# EAGLE schematic MKRWiFi1010V2.0 (EAGLE 9.3.0)

## Sheet 1 of 2
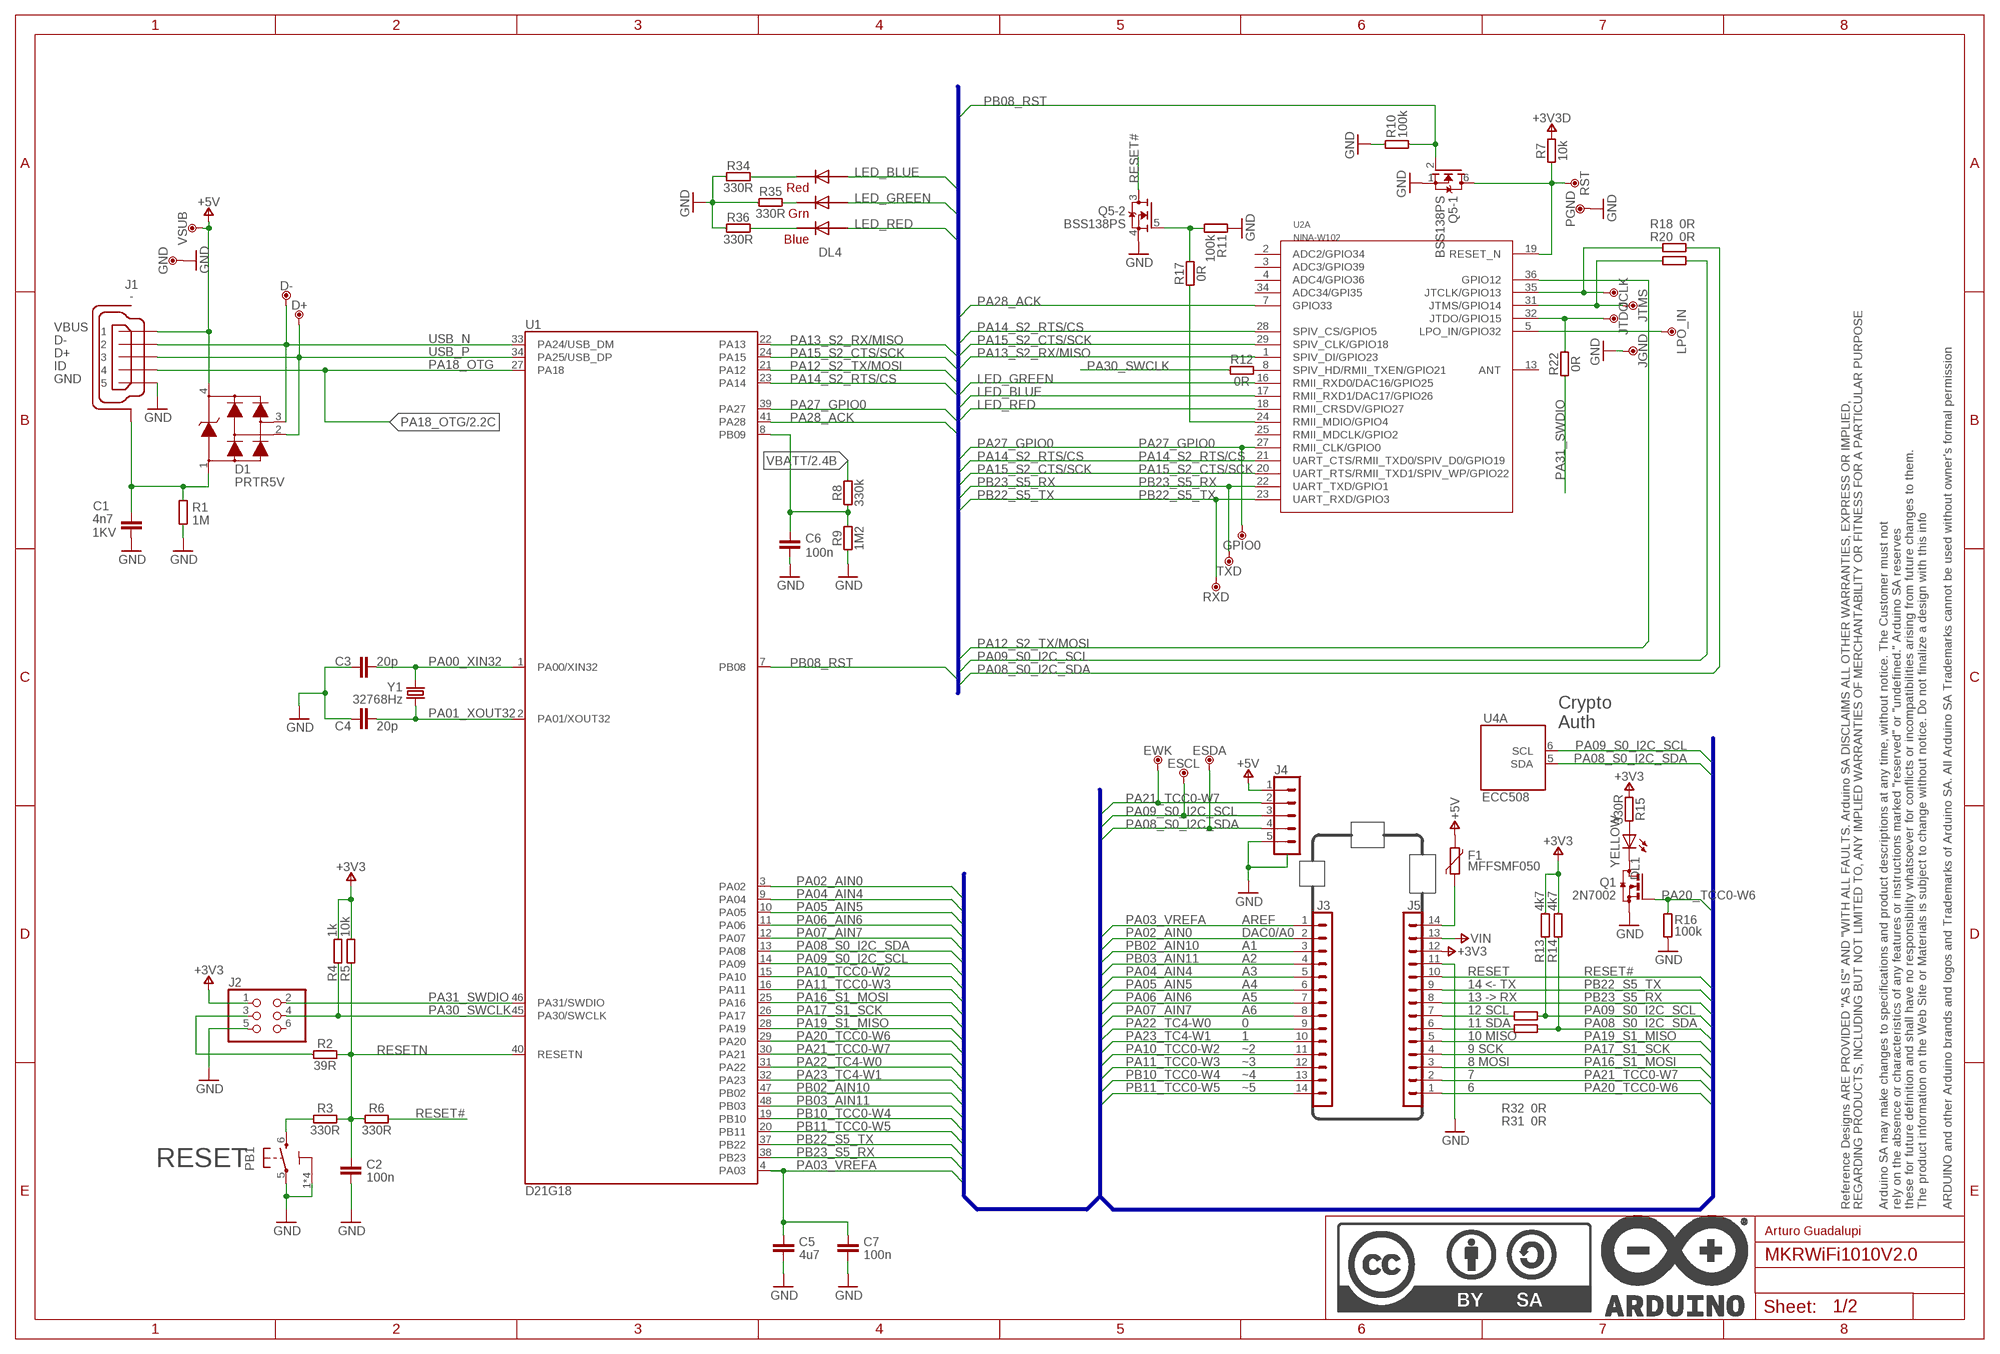
[diagram p0: schematic, sheet 1]

### Parts
C1  4n7  C4.7NF-0805  [0805-R2013X50N]
C2  100n  C-100NF-0402  [0402-1005X55N]
C3  20p  C-20PF-0402  [0402-1005X55N]
C4  20p  C-20PF-0402  [0402-1005X55N]
C5  4u7  C-4.7UF-0402  [0402-1005X55N]
C6  100n  C-100NF-0402  [0402-1005X55N]
C7  100n  C-100NF-0402  [0402-1005X55N]
D1  PRTR5V  PRTR5V0U2X,215  [SOT190P230X110-4N]
D+  DNP  TPTP-1.00MM  [TP-1.00MM]
D-  DNP  TPTP-1.00MM  [TP-1.00MM]
DL1  YELLOW  LED-YELLOW-0603  [LEDC1608X80N-AK]
DL4  RGB  RGBLED5050  [RGBLED]
ESCL  DNP  TPTP-1.00MM  [TP-1.00MM]
ESDA  DNP  TPTP-1.00MM  [TP-1.00MM]
EWK  DNP  TPTP-1.00MM  [TP-1.00MM]
F1  MFFSMF050  PTC  [0603-1608X90N]
FRAME1  DNP  A3-FRAME  [FRAME]
GND  DNP  TPTP-1.00MM  [TP-1.00MM]
GPIO0  DNP  TPTP-0.8MM  [TP-0.8MM]
J1  -  USB-MICRO  [ZX62-AB-5PA]
J2  DNP  PINHD-2X03-DNPSMD-NH  [2X3_SMT]
J3  -  PINHD-1X14-SM-MALE/FEMALETH-SMD  [1X14_SMD_TH]
J4  -  SM05B-SRSS-TB  [SM05B-SRSS-TB]
J5  -  PINHD-1X14-SM-MALE/FEMALETH-SMD  [1X14_SMD_TH]
JCLK  DNP  TPTP-0.8MM  [TP-0.8MM]
JGND  DNP  TPTP-0.8MM  [TP-0.8MM]
JTDO  DNP  TPTP-0.8MM  [TP-0.8MM]
JTMS  DNP  TPTP-0.8MM  [TP-0.8MM]
LPO_IN  DNP  TPTP-1.27MM  [TP-1.27MM]
PB1  PTS820  TACTILE1PTS820-NH  [C&K_PTS820_NO_HOLES]
PGND  DNP  TPTP-0.8MM  [TP-0.8MM]
Q1  2N7002  2N7002T-SOT523  [SOTFL50P160X78-3]
Q5  BSS138PS  [SOT363]
R1  1M  R-1M-0402  [0402-1005X55N]
R2  39R  R-39R-0402  [0402-1005X55N]
R3  330R  R-330R-0402  [0402-1005X55N]
R4  1k  R-1K-0402  [0402-1005X55N]
R5  10k  R-10K-0402  [0402-1005X55N]
R6  330R  R-330R-0402  [0402-1005X55N]
R7  10k  R-10K-0402  [0402-1005X55N]
R8  330k  R-330K-0402  [0402-1005X55N]
R9  1M2  R-1M2-0402  [0402-1005X55N]
R10  100k  R-100K-0402  [0402-1005X55N]
R11  100k  R-100K-0402  [0402-1005X55N]
R12  0R  R-0R-0402  [0402-1005X55N]
R13  4k7  R-4K7-0402  [0402-1005X55N]
R14  4k7  R-4K7-0402  [0402-1005X55N]
R15  330R  R-330R-0402  [0402-1005X55N]
R16  100k  R-100K-0402  [0402-1005X55N]
R17  0R  R-0R-0402  [0402-1005X55N]
R18  0R  R-0R-0402  [0402-1005X55N]
R20  0R  R-0R-0402  [0402-1005X55N]
R22  0R  R-0R-0402  [0402-1005X55N]
R31  0R  R-0R-0402  [0402-1005X55N]
R32  0R  R-0R-0402  [0402-1005X55N]
R34  330R  R-330R-0402  [0402-1005X55N]
R35  330R  R-330R-0402  [0402-1005X55N]
R36  330R  R-330R-0402  [0402-1005X55N]
RST  DNP  TPTP-0.8MM  [TP-0.8MM]
RXD  DNP  TPTP-0.8MM  [TP-0.8MM]
TXD  DNP  TPTP-0.8MM  [TP-0.8MM]
U1  D21G18  ATSAMD21G18A-48QFN  [QFN50P700X700X90-49XN-EPSQ515]
U2  NINA-W102  NINA-W1X-102  [NINA-W1X]
U4  ECC508  ATECC508A-MAHDA-T8-UDFN  [SON50P300X200X60-9N-EP160X140]
VSUB  DNP  TPTP-1.00MM  [TP-1.00MM]
Y1  32768Hz  32.768KHZ  [ABS07]

### Nets
+3V3: J2.1 J5.12 R4.2 R5.2 R13.2 R14.2 R15.1 ; also sheet 2
+3V3D: R7.2 ; also sheet 2
+5V: D1.4 F1.2 J1.1 J4.1 VSUB.X ; also sheet 2
GND: C1.2 C2.2 C3.1 C4.1 C5.2 C6.2 C7.2 GND.X J1.5 J2.5 J4.5 J4.SH1(SH) J4.SH2(SH) J5.11 JGND.X PB1.1 PB1.2 PB1.3 PB1.4 PB1.5 PGND.X Q1.S Q5.1(-1:S) Q5.4(-2:S) R1.1 R9.1 R10.2 R11.2 R16.1 R34.1 R35.1 R36.1 ; also sheet 2
LED_BLUE: DL4.2(RED_A) U2.17(A:RMII_RXD1/DAC17/GPIO26)
LED_GREEN: DL4.1(GREEN_A) U2.16(A:RMII_RXD0/DAC16/GPIO25)
LED_RED: DL4.3(BLUE_A) U2.18(A:RMII_CRSDV/GPIO27)
N17658775: PB1.6 R3.1
N$1: C1.1 D1.1 J1.6(SH) J1.7(SH) J1.8(SH) J1.9(SH) J1.10(SH) J1.11(SH) R1.2
N$2: F1.1 J5.14
N$4: J2.3 R2.1
N$5: J5.7 R32.1
N$6: C6.1 R8.1 R9.2 U1.8(PB09)
N$7: DL1.A R15.2
N$8: J5.6 R31.1
N$9: Q5.6(-1:D) R7.1 RST.X U2.19(A:RESET_N)
N$10: DL1.C Q1.D
N$11: JCLK.X R18.1 U2.35(A:JTCLK/GPIO13)
N$12: JTMS.X R20.1 U2.31(A:JTMS/GPIO14)
N$13: R17.1 U2.24(A:RMII_MDIO/GPIO4)
N$14: DL4.5(RED_C) R34.2
N$16: DL4.6(GREEN_C) R35.2
N$20: DL4.4(BLUE_C) R36.2
N$25: LPO_IN.X U2.5(A:LPO_IN/GPIO32)
N$26: JTDO.X R22.2 U2.32(A:JTDO/GPIO15)
N$27: R12.2 U2.8(A:SPIV_HD/RMII_TXEN/GPIO21)
N$28: Q5.5(-2:G) R11.1 R17.2
PA00_XIN32: C3.2 U1.1(PA00/XIN32) Y1.2
PA01_XOUT32: C4.2 U1.2(PA01/XOUT32) Y1.1
PA02_AIN0: J3.2 U1.3(PA02)
PA03_VREFA: C5.1 C7.1 J3.1 U1.4(PA03)
PA04_AIN4: J3.5 U1.9(PA04)
PA05_AIN5: J3.6 U1.10(PA05)
PA06_AIN6: J3.7 U1.11(PA06)
PA07_AIN7: J3.8 U1.12(PA07)
PA08_S0_I2C_SDA: ESDA.X J4.4 R14.1 R18.2 R31.2 U1.13(PA08) U4.5(A:SDA) ; also sheet 2
PA09_S0_I2C_SCL: ESCL.X J4.3 R13.1 R20.2 R32.2 U1.14(PA09) U4.6(A:SCL) ; also sheet 2
PA10_TCC0-W2: J3.11 U1.15(PA10)
PA11_TCC0-W3: J3.12 U1.16(PA11)
PA12_S2_TX/MOSI: U1.21(PA12) U2.36(A:GPIO12)
PA13_S2_RX/MISO: U1.22(PA13) U2.1(A:SPIV_DI/GPIO23)
PA14_S2_RTS/CS: U1.23(PA14) U2.21(A:UART_CTS/RMII_TXD0/SPIV_D0/GPIO19) U2.28(A:SPIV_CS/GPIO5)
PA15_S2_CTS/SCK: U1.24(PA15) U2.20(A:UART_RTS/RMII_TXD1/SPIV_WP/GPIO22) U2.29(A:SPIV_CLK/GPIO18)
PA16_S1_MOSI: J5.3 U1.25(PA16)
PA17_S1_SCK: J5.4 U1.26(PA17)
PA18_OTG: J1.4 U1.27(PA18) ; also sheet 2
PA19_S1_MISO: J5.5 U1.28(PA19)
PA20_TCC0-W6: J5.1 Q1.G R16.2 U1.29(PA20)
PA21_TCC0-W7: EWK.X J4.2 J5.2 U1.30(PA21)
PA22_TC4-W0: J3.9 U1.31(PA22)
PA23_TC4-W1: J3.10 U1.32(PA23)
PA27_GPIO0: GPIO0.X U1.39(PA27) U2.27(A:RMII_CLK/GPIO0)
PA28_ACK: U1.41(PA28) U2.7(A:GPIO33)
PA30_SWCLK: J2.4 R4.1 R12.1 U1.45(PA30/SWCLK)
PA31_SWDIO: J2.2 R22.1 U1.46(PA31/SWDIO)
PB02_AIN10: J3.3 U1.47(PB02)
PB03_AIN11: J3.4 U1.48(PB03)
PB08_RST: Q5.2(-1:G) R10.1 U1.7(PB08)
PB10_TCC0-W4: J3.13 U1.19(PB10)
PB11_TCC0-W5: J3.14 U1.20(PB11)
PB22_S5_TX: J5.9 RXD.X U1.37(PB22) U2.23(A:UART_RXD/GPIO3)
PB23_S5_RX: J5.8 TXD.X U1.38(PB23) U2.22(A:UART_TXD/GPIO1)
RESET#: J5.10 Q5.3(-2:D) R6.2
RESETN: C2.1 R2.2 R3.2 R5.1 R6.1 U1.40(RESETN)
USB_N [usb]: D1.3 D-.X J1.2 U1.33(PA24/USB_DM)
USB_P [usb]: D1.2 D+.X J1.3 U1.34(PA25/USB_DP)
VBATT: R8.2 ; also sheet 2
VIN: J5.13 ; also sheet 2
Unconnected: J2.6 U2.2(A:ADC2/GPIO34) U2.3(A:ADC3/GPIO39) U2.4(A:ADC4/GPIO36) U2.13(A:ANT) U2.25(A:RMII_MDCLK/GPIO2) U2.34(A:ADC34/GPI35)

### Buses
PA03_VREFA,PA02_AIN0,PB02_AIN10,PB03_AIN11,PA04_AIN4,PA05_AIN5,PA06_AIN6,PA07_AIN7,PA22_TC4-W0,PA23_TC4-W1,PA10_TCC0-W2,PA11_TCC0-W3,PB10_TCC0-W4,PB11_TCC0-W5,PA20_TCC0-W6,PA21_TCC0-W7,PA16_S1_MOSI,PA17_S1_SCK,PA19_S1_MISO,PA08_S0_I2C_SDA,PA09_S0_I2C_SCL,PB23_S5_RX,PB22_S5_TX,RESET#
B$2

### Notes on the sheet
- Crypto
  Auth
- AREF
- DAC0/A0
- A1
- A2
- A3 | RESET
- A4 | 14 <- TX
- A5 | 13 -> RX
- A6 | 12 SCL
- 0 | 11 SDA
- 1 | 10 MISO
- ~2 | 9 SCK
- ~3 | 8 MOSI
- ~4 | 7
- ~5 | 6
- RESET
- Arturo Guadalupi

## Sheet 2 of 2
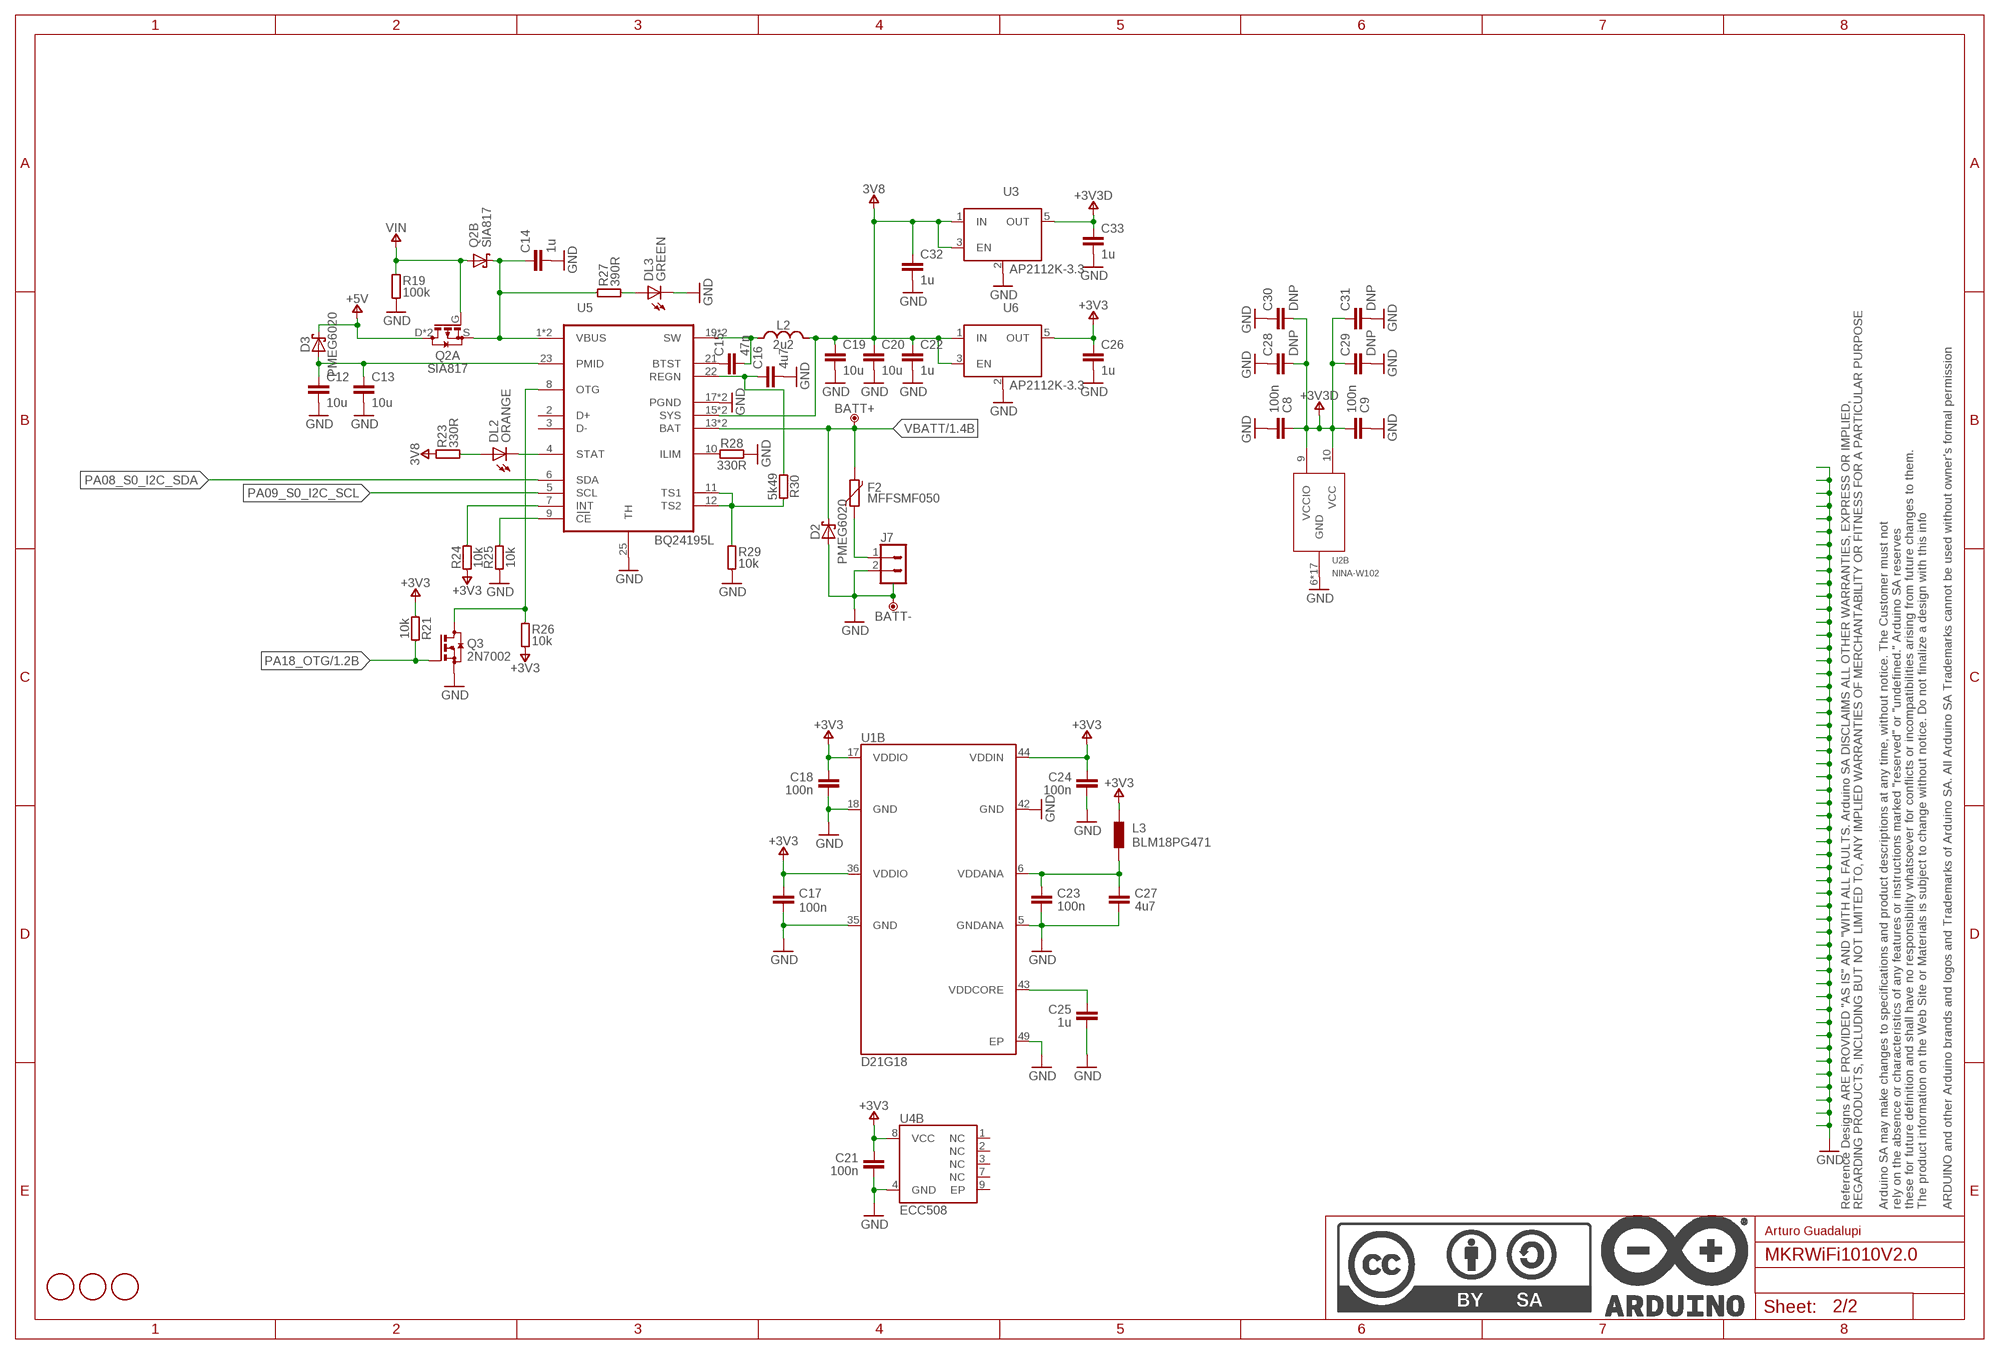
[diagram p1: schematic, sheet 2]

### Parts
BATT+  DNP  TPTP-1.00MM  [TP-1.00MM]
BATT-  DNP  TPTP-1.00MM  [TP-1.00MM]
C8  100n  C-100NF-0402  [0402-1005X55N]
C9  100n  C-100NF-0402  [0402-1005X55N]
C12  10u  C-10UF-0603  [0603-1608X90N]
C13  10u  C-10UF-0603  [0603-1608X90N]
C14  1u  C-1UF-0402  [0402-1005X55N]
C15  47n  C-47N-0402  [0402-1005X55N]
C16  4u7  C-4.7UF-0402  [0402-1005X55N]
C17  100n  C-100NF-0402  [0402-1005X55N]
C18  100n  C-100NF-0402  [0402-1005X55N]
C19  10u  C-10UF-0603  [0603-1608X90N]
C20  10u  C-10UF-0603  [0603-1608X90N]
C21  100n  C-100NF-0402  [0402-1005X55N]
C22  1u  C-1UF-0402  [0402-1005X55N]
C23  100n  C-100NF-0402  [0402-1005X55N]
C24  100n  C-100NF-0402  [0402-1005X55N]
C25  1u  C-1UF-0402  [0402-1005X55N]
C26  1u  C-1UF-0402  [0402-1005X55N]
C27  4u7  C-4.7UF-0603  [0603-1608X90N]
C28  DNP  CDNP-0402  [0402-1005X55N]
C29  DNP  CDNP-0402  [0402-1005X55N]
C30  DNP  C-DNP-0603  [0603-1608X90N]
C31  DNP  C-DNP-0603  [0603-1608X90N]
C32  1u  C-1UF-0402  [0402-1005X55N]
C33  1u  C-1UF-0402  [0402-1005X55N]
D2  PMEG6020  PMEG6020AELRX  [SODFL3517X110N]
D3  PMEG6020  PMEG6020AELRX  [SODFL3517X110N]
DL2  ORANGE  LED-ORANGE-0603  [LEDC1608X80N-AK]
DL3  GREEN  LED-GREEN-0603  [LEDC1608X80N-AK]
F2  MFFSMF050  PTC  [0603-1608X90N]
FD1  DNP  FIDUCIAL-1.5MM  [FD-1-1.5]
FD2  DNP  FIDUCIAL-1.5MM  [FD-1-1.5]
FD3  DNP  FIDUCIAL-1.5MM  [FD-1-1.5]
FRAME2  DNP  A3-FRAME  [FRAME]
J7  -  BATTERY  [JST-S2B-PH-SM4-TB]
L2  2u2  LSRP  [SRP4020]
L3  BLM18PG471  FERRITE-470R0603  [0603-1608X90N]
Q2  SIA817  SIA817EDJ  [SON65P205X205X75-8N-MWSD]
Q3  2N7002  2N7002T-SOT523  [SOTFL50P160X78-3]
R19  100k  R-100K-0402  [0402-1005X55N]
R21  10k  R-10K-0402  [0402-1005X55N]
R23  330R  R-330R-0402  [0402-1005X55N]
R24  10k  R-10K-0402  [0402-1005X55N]
R25  10k  R-10K-0402  [0402-1005X55N]
R26  10k  R-10K-0402  [0402-1005X55N]
R27  390R  R-390R-0402  [0402-1005X55N]
R28  330R  R-330R-0402  [0402-1005X55N]
R29  10k  R-10K-0402  [0402-1005X55N]
R30  5k49  R-5K49-0402  [0402-1005X55N]
U3  AP2112K-3.3  [SOT25]
U5  BQ24195L  BQ24195QFN-24  [QFN24]
U6  AP2112K-3.3  [SOT25]

### Nets
+3V3: C17.1 C18.1 C21.1 C24.1 C26.1 L3.1 R21.1 R24.1 R26.1 U1.17(VDDIO) U1.36(VDDIO) U1.44(VDDIN) U4.8(B:VCC) U6.5(OUT) ; also sheet 1
+3V3D: C8.1 C9.2 C28.2 C29.1 C30.2 C31.1 C33.1 U2.9(B:VCCIO) U2.10(B:VCC) U3.5(OUT) ; also sheet 1
+3V8: C19.1 C20.1 C22.1 C32.1 L2.2 R23.2 U3.1(IN) U3.3(EN) U5.15(SYS) U5.16(SYS) U6.1(IN) U6.3(EN) ; supply symbol labelled 3V8
+5V: D3.C Q2.D2(A:D) Q2.D(A:D) ; also sheet 1
GND: BATT-.X C8.2 C9.1 C12.2 C13.2 C14.2 C16.2 C17.2 C18.2 C19.2 C20.2 C21.2 C22.2 C23.2 C24.2 C25.2 C26.2 C27.2 C28.1 C29.2 C30.1 C31.2 C32.2 C33.2 D2.A DL3.C J7.2 J7.3(SH) J7.4(SH) Q3.S R19.1 R25.1 R28.2 R29.1 U1.5(GNDANA) U1.18(GND) U1.35(GND) U1.42(GND) U1.49(EP) U2.6(B:GND) U2.12(B:GND) U2.14(B:GND) U2.26(B:GND) U2.30(B:GND) U2.GND@1(B:GND) U2.GND@2(B:GND) U2.GND@3(B:GND) U2.GND@4(B:GND) U2.GND@5(B:GND) U2.GND@6(B:GND) U2.GND@7(B:GND) U2.GND@8(B:GND) U2.GND@9(B:GND) U2.GND@10(B:GND) U2.GND@11(B:GND) U2.GND@12(B:GND) U3.2(GND/ADJ) U4.4(B:GND) U5.17(PGND) U5.18(PGND) U5.25(TH) U6.2(GND/ADJ) ; also sheet 1
N17798864: DL2.A R23.1
N17834267: DL3.A R27.1
N17852357: C23.1 C27.1 L3.2 U1.6(VDDANA)
N17852431: C25.1 U1.43(VDDCORE)
N$3: F2.1 J7.1
N$15: C15.2 L2.1 U5.19(SW) U5.20(SW)
N$17: C14.1 Q2.K2(B:C) Q2.K(B:C) Q2.S(A:S) R27.2 U5.1(VBUS) U5.24(VBUS)
N$18: C15.1 U5.21(BTST)
N$19: R28.1 U5.10(ILIM)
N$21: C16.1 R30.1 U5.22(REGN)
N$22: Q3.D R26.2 U5.8(OTG)
N$23: R29.2 R30.2 U5.11(TS1) U5.12(TS2)
N$24: R25.2 U5.9(CE)
PA08_S0_I2C_SDA: U5.6(SDA) ; also sheet 1
PA09_S0_I2C_SCL: U5.5(SCL) ; also sheet 1
PA18_OTG: Q3.G R21.2 ; also sheet 1
PMICINT: R24.2 U5.7(INT)
STAT: DL2.C U5.4(STAT)
VBATT: BATT+.X D2.C F2.2 U5.13(BAT) U5.14(BAT) ; also sheet 1
VIN: Q2.A(B:A) Q2.G(A:G) R19.2 ; also sheet 1
VUSB1: C12.1 C13.1 D3.A U5.23(PMID)
Unconnected: U4.1(B:NC) U4.2(B:NC) U4.3(B:NC) U4.7(B:NC) U4.9(B:EP) U5.2(D+) U5.3(D-)

### Notes on the sheet
- Arturo Guadalupi

## Library data of the parts
BATT+ BATT- D+ D- ESCL ESDA EWK GND GPIO0 JCLK JGND JTDO JTMS LPO_IN PGND RST RXD TXD VSUB = Arduino-utility:TP: Testpoint; CODE-ARDUINO: DNP; DATASHEET: DNP; DISTRIBUTOR-LINK: DNP; DISTRIBUTOR-PN: DNP; MANUFACTURER: DNP; MANUFACTURER-PN: DNP
C1 = Arduino-rcl:C: SMD Capacitor; CODE-ARDUINO: 0689; DATASHEET: http://www.kemet.com/Lists/ProductCatalog/Attachments/40/KEM_C1010_X7R_HV_SMD.pdf; DISTRIBUTOR-LINK: www.kemet.com/docfinder?Partnumber=C0805C472KDRACTU; DISTRIBUTOR-PN: 399-6738-1-ND; MANUFACTURER: Kemet; MANUFACTURER-PN: C0805C472KDRACTU; VOLTAGE: 1KV
C2 C6-C9 C17 C18 C21 C23 C24 = Arduino-rcl:C: SMD Capacitor; CODE-ARDUINO: 0132; DATASHEET: http://www.tdk.com/pdf/TDKMLCCCapRange.pdf; DISTRIBUTOR-LINK: http://www.digikey.com/product-detail/en/tdk-corporation/C1005X5R1H104K050BB/445-5942-1-ND/2443982; DISTRIBUTOR-PN: 445-5942-1-ND; MANUFACTURER: TDK; MANUFACTURER-PN: C1005X5R1H104K050BB
C3 C4 = Arduino-rcl:C: SMD Capacitor; CODE-ARDUINO: 2188; DATASHEET: http://www.kemet.com/docfinder?Partnumber=CBR04C200J5GAC; DISTRIBUTOR-LINK: http://www.digikey.com/product-detail/en/kemet/CBR04C200J5GAC/399-6173-1-ND/2732143; DISTRIBUTOR-PN: 399-6173-1-ND; MANUFACTURER: Kemet; MANUFACTURER-PN: CBR04C200J5GAC
C5 C16 = Arduino-rcl:C: SMD Capacitor; CODE-ARDUINO: 0833; DATASHEET: http://search.murata.co.jp/Ceramy/image/img/A01X/partnumbering_e_01.pdf; DISTRIBUTOR-LINK: http://www.digikey.com/product-detail/en/murata-electronics-north-america/GRM155R60J475ME47D/490-5915-1-ND/3719860; DISTRIBUTOR-PN: 490-5915-1-ND; MANUFACTURER: Murata; MANUFACTURER-PN: GRM155R60J475ME47D
C12 C13 C19 C20 = Arduino-rcl:C: SMD Capacitor; CODE-ARDUINO: 2213; DATASHEET: http://www.murata.com/~/media/webrenewal/support/library/catalog/products/capacitor/mlcc/c02e.pdf; DISTRIBUTOR-LINK: http://www.digikey.com/product-search/en?keywords=490-10728-1-ND; DISTRIBUTOR-PN: 490-10728-1-ND; MANUFACTURER: Murata; MANUFACTURER-PN: GRM188R61C106KAALD
C14 C22 C25 C26 C32 C33 = Arduino-rcl:C: SMD Capacitor; CODE-ARDUINO: -; DATASHEET: http://search.murata.co.jp/Ceramy/image/img/A01X/partnumbering_e_01.pdf; DISTRIBUTOR-LINK: http://www.digikey.com/product-detail/en/murata-electronics-north-america/GRM155R61E105KA12D/490-10017-1-ND/5026367; DISTRIBUTOR-PN: 490-10017-1-ND; MANUFACTURER: Murata; MANUFACTURER-PN: GRM155R61E105KA12D
C15 = Arduino-rcl:C: SMD Capacitor; CODE-ARDUINO: 2216; DATASHEET: http://www.murata.com/~/media/webrenewal/support/library/catalog/products/capacitor/mlcc/c02e.pdf; DISTRIBUTOR-LINK: https://www.digikey.com/product-detail/en/murata-electronics-north-america/GRM155R71E473KA88D/490-3254-1-ND/702795; DISTRIBUTOR-PN: 490-3254-1-ND; MANUFACTURER: Murata; MANUFACTURER-PN: GRM155R71E473KA88D
C27 = Arduino-rcl:C: SMD Capacitor; CODE-ARDUINO: 0458; DATASHEET: http://www.murata.com/~/media/webrenewal/support/library/catalog/products/capacitor/mlcc/c02e.pdf; DISTRIBUTOR-LINK: http://www.digikey.com/product-search/en?keywords=490-7203-1-ND; DISTRIBUTOR-PN: 490-7203-1-ND; MANUFACTURER: Murata; MANUFACTURER-PN: GRM188R61E475KE11D
C28-C31 = Arduino-rcl:C: SMD Capacitor; CODE-ARDUINO: DNP; DATASHEET: DNP; DISTRIBUTOR-LINK: DNP; DISTRIBUTOR-PN: DNP; MANUFACTURER: DNP; MANUFACTURER-PN: DNP
D1 = Arduino-diodes:PRTR5V0U2X,215: USB ESD protection; CODE-ARDUINO: 2209; DATASHEET: http://www.nxp.com/documents/data_sheet/PRTR5V0U2X.pdf; DISTRIBUTOR-LINK: http://www.digikey.com/product-detail/en/nxp-semiconductors/PRTR5V0U2X,215/568-4140-1-ND/1589981; DISTRIBUTOR-PN: 568-4140-1-ND; MANUFACTURER: NXP; MANUFACTURER-PN: PRTR5V0U2X,215
D2 D3 = Arduino-diodes:PMEG6020AELRX: 60 V, 2 A low leakage current Schottky barrier rectifier Datasheet <http://www.nxp.com/documents/data_sheet/PMEG6020AELR.pdf>; CODE-ARDUINO: 2208; DATASHEET: http://www.nxp.com/documents/data_sheet/PMEG6020AELR.pdf; DISTRIBUTOR-LINK: http://www.digikey.com/products/en?keywords=%20568-12710-1-ND; DISTRIBUTOR-PN: 568-12710-1-ND; MANUFACTURER: NXP; MANUFACTURER-PN: PMEG6020AELRX
DL1 = Arduino-diodes:LED: LED; CODE-ARDUINO: 2243; DATASHEET: http://media.digikey.com/pdf/Data%20Sheets/Avago%20PDFs/HSMz-Czzz.pdf; DISTRIBUTOR-LINK: http://www.digikey.com/product-detail/en/broadcom-limited/HSMY-C190/516-1424-1-ND/637748; DISTRIBUTOR-PN: 516-1424-1-ND; MANUFACTURER: Avago; MANUFACTURER-PN: HSMY-C190
DL2 = Arduino-diodes:LED: LED; CODE-ARDUINO: 2207; DATASHEET: http://media.digikey.com/pdf/Data%20Sheets/Avago%20PDFs/HSMz-Czzz.pdf; DISTRIBUTOR-LINK: http://www.digikey.com/product-detail/en/broadcom-limited/HSMD-C190/516-2489-1-ND/2744915; DISTRIBUTOR-PN: 516-2489-1-ND; MANUFACTURER: Avago; MANUFACTURER-PN: HSMD-C190
DL3 = Arduino-diodes:LED: LED; CODE-ARDUINO: 2204; DATASHEET: http://media.digikey.com/pdf/Data%20Sheets/Avago%20PDFs/HSMz-Czzz.pdf; DISTRIBUTOR-LINK: http://www.digikey.com/product-detail/en/broadcom-limited/HSMG-C190/516-1425-1-ND/637749; DISTRIBUTOR-PN: 516-1425-1-ND; MANUFACTURER: Avago; MANUFACTURER-PN: HSMG-C190
DL4 = Arduino-diodes:RGBLED: 5050 RGB LED; CODE-ARDUINO: 2211; DATASHEET: http://www.osram-os.com/Graphics/XPic9/00134830_0.pdf; DISTRIBUTOR-LINK: https://www.digikey.com/product-detail/en/osram-opto-semiconductors-inc/LTRBGFSF-ABCB-QKYO-Z/475-2899-1-ND/2415091; DISTRIBUTOR-PN: 475-2899-1-ND; MANUFACTURER: OSRAM Opto Semiconductors Inc.; MANUFACTURER-PN: LTRBGFSF-ABCB-QKYO-Z
F1 F2 = Arduino-rcl:PTC: SMD PTC; CODE-ARDUINO: 2217; DATASHEET: http://www.bourns.com/docs/Product-Datasheets/mffsmf.pdf; DISTRIBUTOR-LINK: http://www.digikey.com/product-detail/en/bourns-inc/MF-FSMF050X-2/MF-FSMF050X-2CT-ND/2039389; DISTRIBUTOR-PN: MF-FSMF050X-2CT-ND; MANUFACTURER: Bourns Inc; MANUFACTURER-PN: MF-FSMF050X-2
FD1-FD3 = Arduino-utility:FIDUCIAL: Fiducial mount; CODE-ARDUINO: DNP; DATASHEET: DNP; DISTRIBUTOR-LINK: DNP; DISTRIBUTOR-PN: DNP; MANUFACTURER: DNP; MANUFACTURER-PN: DNP
FRAME1 FRAME2 = Arduino-utility:A3-FRAME; CODE-ARDUINO: DNP; DATASHEET: DNP; DISTRIBUTOR-LINK: DNP; DISTRIBUTOR-PN: DNP; MANUFACTURER: DNP; MANUFACTURER-PN: DNP; NOTE: DNP
J1 = Arduino-connectors:USB-MICRO: USB - micro AB USB 2.0 Receptacle Connector 5 Position Surface Mount, Right Angle, Horizontal; CODE-ARDUINO: 2219; DATASHEET: https://www.hirose.com/product/en/download_file/key_name/ZX/category/Catalog/doc_file_id/31704/?file_category_id=4&item_id=13&is_series=1; DISTRIBUTOR-LINK: http://www.digikey.com/product-detail/en/hirose-electric-co-ltd/ZX62-AB-5PA(31)/H125279CT-ND/5994741; DISTRIBUTOR-PN: H125279CT-ND; MANUFACTURER: Hirose; MANUFACTURER-PN: ZX62-AB-5PA(31)
J2 = Arduino-connectors:PINHD-2X03: PIN HEADER; CODE-ARDUINO: DNP; DATASHEET: DNP; DISTRIBUTOR-LINK: DNP; DISTRIBUTOR-PN: DNP; MANUFACTURER: DNP; MANUFACTURER-PN: DNP
J3 J5 = Arduino-connectors:PINHD-1X14-SM: PIN HEADER; CODE-ARDUINO: -; DATASHEET: -; DISTRIBUTOR-LINK: -; DISTRIBUTOR-PN: -; MANUFACTURER: ELDECO; MANUFACTURER-PN: FH254114DF08500T
J4 = Arduino-connectors:SM05B-SRSS-TB: CONN HEADER SH 5POS SIDE 1MM TIN Datasheet <http://www.jst-mfg.com/product/pdf/eng/eSH.pdf>; CODE-ARDUINO: 2353; DATASHEET: http://www.jst-mfg.com/product/pdf/eng/eSH.pdf; DISTRIBUTOR-LINK: http://www.digikey.com/product-detail/en/jst-sales-america-inc/SM05B-SRSS-TB(LF)(SN)/455-1805-1-ND/926876; DISTRIBUTOR-PN: 455-1805-1-ND; MANUFACTURER: JST; MANUFACTURER-PN: SM05B-SRSS-TB
J7 = Arduino-connectors:BATTERY: CONN HEADER PH SIDE 2POS 2MM SMD; CODE-ARDUINO: 2355; DATASHEET: http://www.jst-mfg.com/product/pdf/eng/ePH.pdf; DISTRIBUTOR-LINK: http://www.digikey.com/product-detail/en/jst-sales-america-inc/S2B-PH-SM4-TB%28LF%29%28SN%29/455-1749-1-ND/926846; DISTRIBUTOR-PN: 455-1749-1-ND; MANUFACTURER: JST; MANUFACTURER-PN: S2B-PH-SM4-TB(LF)(SN)
L2 = Arduino-rcl:L: Inductors; CODE-ARDUINO: 2218; DATASHEET: http://www.bourns.com/docs/Product-Datasheets/SRP4020TA.pdf; DISTRIBUTOR-LINK: https://www.digikey.com/product-detail/en/bourns-inc/SRP4020TA-2R2M/SRP4020TA-2R2MCT-ND/4901068; DISTRIBUTOR-PN: SRP4020TA-2R2MCT-ND; MANUFACTURER: Bourns; MANUFACTURER-PN: SRP4020TA-2R2M
L3 = Arduino-rcl:FERRITE: SMD ferrite; CODE-ARDUINO: 2217; DATASHEET: http://search.murata.co.jp/Ceramy/image/img/PDF/ENG/L0110S0100BLM18P.pdf; DISTRIBUTOR-LINK: http://www.digikey.com/product-detail/en/murata-electronics-north-america/BLM18PG471SN1D/490-5223-1-ND/1948399; DISTRIBUTOR-PN: 490-5223-1-ND; MANUFACTURER: Murata; MANUFACTURER-PN: BLM18PG471SN1D
PB1 = Arduino-pushbuttons:TACTILE1: Tactile Switch SPST-NO Top Actuated Surface Mount; CODE-ARDUINO: 0277; DATASHEET: http://www.ckswitches.com/media/1474/pts820.pdf; DISTRIBUTOR-LINK: https://www.digikey.com/product-detail/en/c-k/PTS820-J15M-SMTR-LFS/CKN10506CT-ND/4176681; DISTRIBUTOR-PN: PTS820 J25K SMTR LFS-ND; MANUFACTURER: C&K; MANUFACTURER-PN: PTS820 J25K SMTR LFS
Q1 Q3 = Arduino-transistors:2N7002T: MOSFET N-CH 60V 115MA; CODE-ARDUINO: 1612; DATASHEET: http://www.diodes.com/_files/datasheets/ds30301.pdf; DISTRIBUTOR-LINK: http://www.digikey.com/product-detail/en/diodes-incorporated/2N7002T-7-F/2N7002T-FDICT-ND/815290; DISTRIBUTOR-PN: 2N7002T-FDICT-ND; MANUFACTURER: Diodes Incorporated; MANUFACTURER-PN: 2N7002T-7-F
Q2 = Arduino-transistors:SIA817EDJ: MOSFET P-CH 30V 4.5A SC-70-6; CODE-ARDUINO: 2220; DATASHEET: http://www.vishay.com/docs/62820/sia817edj.pdf; DISTRIBUTOR-LINK: http://www.digikey.com/product-detail/en/vishay-siliconix/SIA817EDJ-T1-GE3/SIA817EDJ-T1-GE3CT-ND/4142098; DISTRIBUTOR-PN: SIA817EDJ-T1-GE3CT-ND; MANUFACTURER: Vishay; MANUFACTURER-PN: SIA817EDJ-T1-GE3
Q5 = Arduino-transistors:BSS138PS: MOSFET 2N-CH 60V 0.32A 6TSSOP; DATASHEET: http://www.nxp.com/documents/data_sheet/BSS138PS.pdf; DISTRIBUTOR-LINK: http://www.digikey.com/product-detail/en/nxp-semiconductors/BSS138PS,115/568-8393-1-ND/2763927; DISTRIBUTOR-PN: 568-8393-1-ND; MANUFACTURER: NXP; MANUFACTURER-PN: BSS138PS,115
R1 = Arduino-rcl:R: SMD Resistor; CODE-ARDUINO: 0139; DATASHEET: www.yageo.com.tw/exep/pages/download/literatures/PYu-R_INT-thick_7.pdf; DISTRIBUTOR-LINK: http://www.digikey.com/product-detail/en/yageo/RC0402JR-07330RL/311-330JRCT-ND/729412; DISTRIBUTOR-PN: 311-330JRCT-ND; MANUFACTURER: Yageo; MANUFACTURER-PN: RC0402JR-07330RL
R2 = Arduino-rcl:R: SMD Resistor; CODE-ARDUINO: 0138; DATASHEET: www.yageo.com.tw/exep/pages/download/literatures/PYu-R_INT-thick_7.pdf; DISTRIBUTOR-LINK: http://www.digikey.com/product-detail/en/yageo/RC0402FR-0739RL/311-39.0LRCT-ND/729549; DISTRIBUTOR-PN: 311-39.0LRCT-ND; MANUFACTURER: Yageo; MANUFACTURER-PN: RC0402FR-0739RL
R3 R6 R15 R23 R28 R34-R36 = Arduino-rcl:R: SMD Resistor; CODE-ARDUINO: 2229; DATASHEET: www.yageo.com.tw/exep/pages/download/literatures/PYu-R_INT-thick_7.pdf; DISTRIBUTOR-LINK: http://www.digikey.com/product-detail/en/yageo/RC0402FR-07330RL/311-330LRCT-ND/729541; DISTRIBUTOR-PN: 311-330LRCT-ND; MANUFACTURER: Yageo; MANUFACTURER-PN: RC0402FR-07330RL
R4 = Arduino-rcl:R: SMD Resistor; CODE-ARDUINO: 0140; DATASHEET: www.yageo.com.tw/exep/pages/download/literatures/PYu-R_INT-thick_7.pdf; DISTRIBUTOR-LINK: http://www.digikey.com/product-detail/en/yageo/RC0402FR-071KL/311-1.00KLRCT-ND/729460; DISTRIBUTOR-PN: 311-1.00KLRCT-ND; MANUFACTURER: Yageo; MANUFACTURER-PN: RC0402FR-071KL
R5 R7 R21 R24-R26 R29 = Arduino-rcl:R: SMD Resistor; CODE-ARDUINO: 0136; DATASHEET: www.yageo.com.tw/exep/pages/download/literatures/PYu-R_INT-thick_7.pdf; DISTRIBUTOR-LINK: http://www.digikey.com/product-detail/en/yageo/RC0402FR-0710KL/311-10.0KLRCT-ND/729470; DISTRIBUTOR-PN: 311-10.0KLRCT-ND; MANUFACTURER: Yageo; MANUFACTURER-PN: RC0402FR-0710KL
R8 = Arduino-rcl:R: SMD Resistor; CODE-ARDUINO: 2192; DATASHEET: www.yageo.com.tw/exep/pages/download/literatures/PYu-R_INT-thick_7.pdf; DISTRIBUTOR-LINK: http://www.digikey.com/product-detail/en/yageo/RC0402JR-07330KL/311-330KJRCT-ND/729413; DISTRIBUTOR-PN: 311-330KJRCT-ND; MANUFACTURER: Yageo; MANUFACTURER-PN: RC0402JR-07330KL
R9 = Arduino-rcl:R: SMD Resistor; CODE-ARDUINO: 2352; DATASHEET: www.yageo.com.tw/exep/pages/download/literatures/PYu-R_INT-thick_7.pdf; DISTRIBUTOR-LINK: http://www.digikey.com/products/en?keywords=RC0402FR-071M2L-ND; DISTRIBUTOR-PN: RC0402FR-071M2L-ND; MANUFACTURER: Yageo; MANUFACTURER-PN: RC0402FR-071M2L
R10 R11 R16 R19 = Arduino-rcl:R: SMD Resistor; CODE-ARDUINO: 0134; DATASHEET: www.yageo.com.tw/exep/pages/download/literatures/PYu-R_INT-thick_7.pdf; DISTRIBUTOR-LINK: http://www.digikey.com/product-detail/en/yageo/RC0402FR-07100KL/311-100KLRCT-ND/729473; DISTRIBUTOR-PN: 311-100KLRCT-ND; MANUFACTURER: Yageo; MANUFACTURER-PN: RC0402FR-07100KL
R12 R17 R18 R20 R22 R31 R32 = Arduino-rcl:R: SMD Resistor; CODE-ARDUINO: 0039; DATASHEET: www.yageo.com.tw/exep/pages/download/literatures/PYu-R_INT-thick_7.pdf; DISTRIBUTOR-LINK: http://www.digikey.com/product-detail/en/yageo/RC0402FR-070RL/311-0.0LRCT-ND/2827888; DISTRIBUTOR-PN: 311-0.0LRCT-ND; MANUFACTURER: Yageo; MANUFACTURER-PN: RC0402FR-070RL
R13 R14 = Arduino-rcl:R: SMD Resistor; CODE-ARDUINO: 2196; DATASHEET: www.yageo.com.tw/exep/pages/download/literatures/PYu-R_INT-thick_7.pdf; DISTRIBUTOR-LINK: http://www.digikey.com/product-detail/en/yageo/RC0402FR-074K7L/311-4.7KLRCT-ND/2827881; DISTRIBUTOR-PN: 311-4.7KLRCT-ND; MANUFACTURER: Yageo; MANUFACTURER-PN: RC0402FR-074K7L
R27 = Arduino-rcl:R: SMD Resistor; CODE-ARDUINO: 2195; DATASHEET: www.yageo.com.tw/exep/pages/download/literatures/PYu-R_INT-thick_7.pdf; DISTRIBUTOR-LINK: https://www.digikey.com/product-detail/en/yageo/RC0402FR-07390RL/311-390LRCT-ND/2827929; DISTRIBUTOR-PN: 311-390LRCT-ND; MANUFACTURER: Yageo; MANUFACTURER-PN: RC0402FR-07390RL
R30 = Arduino-rcl:R: SMD Resistor; CODE-ARDUINO: 2197; DATASHEET: www.yageo.com.tw/exep/pages/download/literatures/PYu-R_INT-thick_7.pdf; DISTRIBUTOR-LINK: https://www.digikey.com/product-detail/en/yageo/RC0402FR-075K49L/311-5.49KLRCT-ND/729573; DISTRIBUTOR-PN: 311-5.49KLRCT-ND; MANUFACTURER: Yageo; MANUFACTURER-PN: RC0402FR-075K49L
U1 = Arduino-ucs&SoCs:ATSAMD21G18A-48: ARM® Cortex®-M0+ SAM D21G Microcontroller IC 32-Bit 48MHz 256KB (256K x 8) FLASH 48-TQFP (7x7); CODE-ARDUINO: 2202; DATASHEET: http://www.atmel.com/Images/Atmel-42181-SAM-D21_Datasheet.pdf; DISTRIBUTOR-LINK: https://www.digikey.com/product-detail/en/microchip-technology/ATSAMD21G18A-MU/ATSAMD21G18A-MU-ND/4935894; DISTRIBUTOR-PN: ATSAMD21G18A-MU-ND; MANUFACTURER: Atmel; MANUFACTURER-PN: ATSAMD21G18A-MU
U2 = Arduino-ucs&SoCs:NINA-W1X: ESP32 WiFi/BLE module; CODE-ARDUINO: 2205; DATASHEET: https://www.u-blox.com/sites/default/files/NINA-W1_DataSheet_%28UBX-17006694%29.pdf; DISTRIBUTOR-LINK: https://www.digikey.com/product-detail/en/u-blox-america-inc/NINA-W102/672-1070-1-ND/7931820; DISTRIBUTOR-PN: 672-1070-1-ND; MANUFACTURER: Ublocks; MANUFACTURER-PN: NINA-W102
U3 U6 = Arduino-ICs:AP2112K-3.3: IC REG LINEAR 3.3V 600mA SOT25; CODE-ARDUINO: 2199; DATASHEET: https://www.diodes.com/assets/Datasheets/AP2112.pdf; DISTRIBUTOR-LINK: https://www.digikey.com/product-detail/en/diodes-incorporated/AP2112K-3.3TRG1/AP2112K-3.3TRG1DITR-ND/4470746; DISTRIBUTOR-PN: AP2112K-3.3TRG1DITR-ND; MANUFACTURER: Diodes Inc; MANUFACTURER-PN: AP2112K-3.3TRG1
U4 = Arduino-ICs:ATECC508A-MAHDA-T: Secure authentication and product validation device, EEPROM, I2C, 2.0 - 5.5V; CODE-ARDUINO: 2203; DATASHEET: http://www.atmel.com/Images/Atmel-8923S-CryptoAuth-ATECC508A-Datasheet-Summary.pdf; DISTRIBUTOR-LINK: http://www.digikey.com/product-detail/en/atmel/ATECC508A-MAHDA-T/ATECC508A-MAHDA-TCT-ND/5213071; DISTRIBUTOR-PN: ATECC508A-MAHDA-TCT-ND; MANUFACTURER: Atmel; MANUFACTURER-PN: ATECC508A-MAHDA-T
U5 = Arduino-ICs:BQ24195: IC CHRG MGMT LI-ION/POL; CODE-ARDUINO: 2201; DATASHEET: http://www.ti.com/lit/ds/symlink/bq24195.pdf; DISTRIBUTOR-LINK: https://www.digikey.com/product-detail/en/texas-instruments/BQ24195LRGET/296-35047-1-ND/3725759; DISTRIBUTOR-PN: 296-35047-1-ND; MANUFACTURER: Texas Instruments; MANUFACTURER-PN: BQ24195LRGET
Y1 = Arduino-crystals:32.768KHZ: LF crystal; CODE-ARDUINO: 0213; DATASHEET: http://www.abracon.com/Resonators/ABS07.pdf; DISTRIBUTOR-LINK: http://www.digikey.com/product-detail/en/abracon-llc/ABS07-32.768KHZ-T/535-9542-1-ND/1237009; DISTRIBUTOR-PN: 535-9542-1-ND; MANUFACTURER: Abracon LLC; MANUFACTURER-PN: ABS07-32.768KHZ-T

## Net classes
0 default: width 0.19 mm, drill 0.19 mm
1 usb: width 0.19 mm, drill 0.19 mm, clearance 0.127 mm